# Altium schematic sheet 4_cyber60-mxhs_power.SchDoc: =ProjectTitle
size A4; Address1: github.com/4pplet/cyber60; Address2: Licence: CERN-OHL-S; SheetNumber: 4; SheetTotal: 5
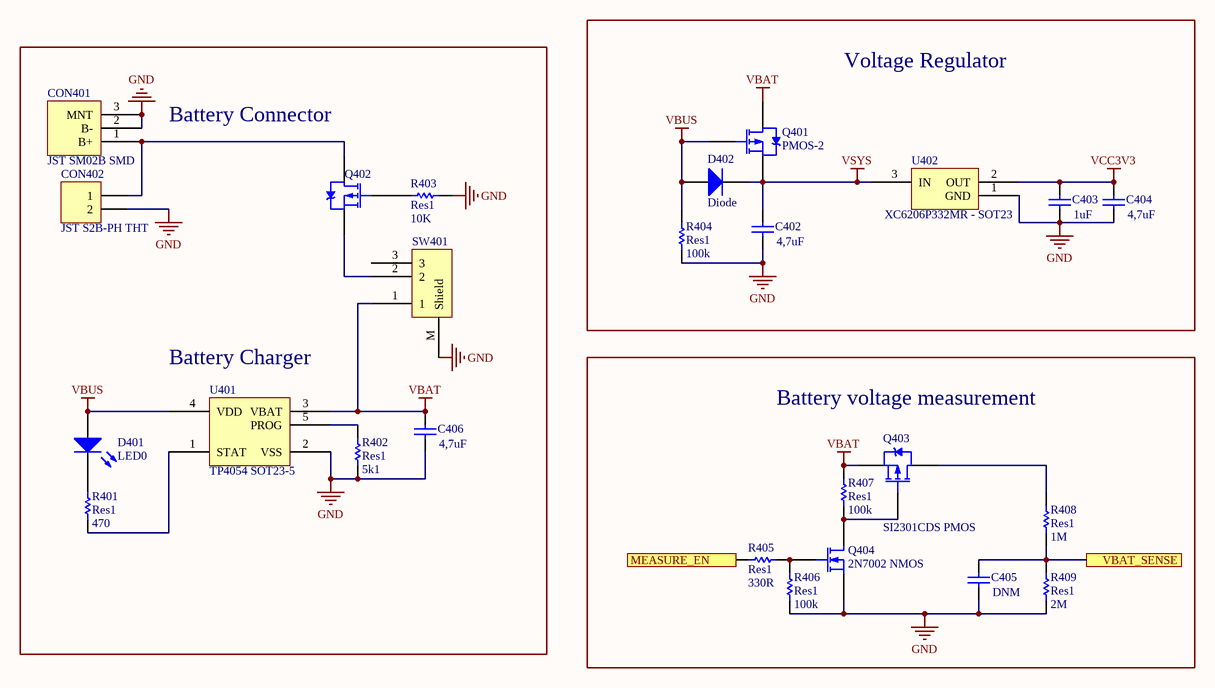
[diagram p0: 4_cyber60-mxhs_power.SchDoc]

## Parts
C402  value 4,7uF  [C0603[1608]]
C403  value 1uF  [C0603[1608]]
C404  value 4,7uF  [C0603[1608]]
C405  DNM  [C0603[1608]]  (no BOM)
C406  value 4,7uF  [C0603[1608]]
CON401  JST SM02B SMD  [JST SM02B-SRSS-TB]
CON402  JST S2B-PH THT  [JST S2B-PH-K(LF)(SN)]  (no BOM)
D401  LED0  [LED0603[1608]]
D402  Diode  [SOD-123]
Q401  PMOS-2  [SOT-23-3]
Q402  PMOS-2  [SOT-23-3]  (value not drawn)
Q403  SI2301CDS PMOS  [SOT-23-3]
Q404  2N7002 NMOS  [SOT-23-3]
R401  Res1  value 470  [R0603[1608]]
R402  Res1  value 5k1  [R0603[1608]]
R403  Res1  value 10K  [R0603[1608]]
R404  Res1  value 100k  [R0603[1608]]
R405  Res1  value 330R  [R0603[1608]]
R406  Res1  value 100k  [R0603[1608]]
R407  Res1  value 100k  [R0603[1608]]
R408  Res1  value 1M  [R0603[1608]]
R409  Res1  value 2M  [R0603[1608]]
SW401  Korean Hroparts Elec K3-1296S-E2  [Korean Hroparts Elec K3-1296S-E2]  (value not drawn)
U401  TP4054 SOT23-5  [SOT-23-5]
U402  XC6206P332MR - SOT23  [SOT-23-3]

## Blocks framed on the sheet
Voltage Regulator: C402-C404 D402 Q401 R404 U402
Battery voltage measurement: C405 Q403 Q404 R405-R409

## Ports
MEASURE_EN, VBAT_SENSE

## Nets
GND: C402.1 C403.1 C404.1 C405.1 C406.1 CON401.2(B-) CON401.3(MNT) CON402.2 Q404.2(S) R402.2 R403.2 R404.2 R406.2 R409.2 SW401.M(Shield) U401.2(VSS) U402.1(GND)
VBAT: C406.2 Q401.3(D) Q403.2(S) R407.1 SW401.1 U401.3(VBAT)
VBUS: D401.1(A) D402.1(A) Q401.1(G) R404.1 U401.4(VDD)
VCC3V3: C403.2 C404.2 U402.2(OUT)
VSYS: C402.2 D402.2(K) Q401.2(S) U402.3(IN)
MEASURE_EN: R405.1 ; port MEASURE_EN
VBAT_SENSE: C405.2 R408.2 R409.1 ; port VBAT_SENSE
NetCON401_1: CON401.1(B+) CON402.1 Q402.3(D)
NetD401_2: D401.2(K) R401.2
NetQ402_1: Q402.1(G) R403.1
NetQ402_2: Q402.2(S) SW401.2
NetQ403_1: Q403.1(G) Q404.3(D) R407.2
NetQ403_3: Q403.3(D) R408.1
NetQ404_1: Q404.1(G) R405.2 R406.1
NetR401_1: R401.1 U401.1(STAT)
NetR402_1: R402.1 U401.5(PROG)

Not connected (* = marked no-connect by the designer): SW401 3

## Notes on the sheet
- Battery Connector
- (near U401) Battery Charger
- Title
- Size:
- Date:
- A4
- Number:
- Time:
- Revision:
- Sheet
- of
- File:

## Library data of the parts
C402 C404 C406 = Cap: Capacitor; MRF.Part: CL10A475KO8NNNC; LCSC MFG: Samsung Electro-Mechanics; LCSC Part #: C19666
C403 = Cap: Capacitor; MRF.Part: CL10A105KB8NNNC; MFG: KEMET; MFGPN: C0603C104M5RACTU; LCSC MFG: Samsung Electro-Mechanics; Version: 0603 imperial; LCSC Part #: C15849
C405 = Cap: Capacitor; Value: DNM; Version: 0603 imperial
CON401 = JST S2B-PH-SM4-TB: MRF.Part: SM02B-SRSS-TB(LF)(SN); LCSC MFG: JST Sales America; LCSC Part #: C160402
CON402 = Header 2: Header, 2-Pin; MRF.Part: S2B-PH-K(LF)(SN); LCSC MFG: JST Sales America; LCSC Part #: C265016
D401 = LED0: Typical INFRARED GaAs LED; MRF.Part: 19-213/Y2C-CQ2R2L/3T(CY); LCSC MFG: Everlight Elec; LCSC Part #: C72038
D402 = Diode: Default Diode; MRF.Part: B5819W; LCSC MFG: Changjiang Electronics Tech (CJ); Version: SOD-123; LCSC Part #: C8598
Q401 Q403 = PMOS-2: P-Channel Power MOSFET; MRF.Part: SI2301CDS-T1-GE3; Note: Pin 4 not drawn and electrically connected to Pin 2.; LCSC MFG: Vishay Intertech; LCSC Part #: C10487
Q402 = PMOS-2: P-Channel Power MOSFET; MRF.Part: SI2301CDS-T1-GE3; LCSC MFG: Vishay Intertech; LCSC Part #: C10487; Version: SOT23-3
Q404 = MOSFET-N: N-Channel MOSFET; LCSC MFG: Changjiang Electronics Tech (CJ); LCSC Part #: C8545; MRF.Part: 2N7002
R401 = Res1: Resistor; MRF.Part: 0603WAF4700T5E; MFG: Panasonic Electronic Components; MFGPN: ERJ-3EKF5101V; LCSC MFG: UNI-ROYAL(Uniroyal Elec); Version: 0603 imperial; LCSC Part #: C23179
R402 = Res1: Resistor; MRF.Part: 0603WAF5101T5E; MFG: Panasonic Electronic Components; MFGPN: ERJ-3EKF5101V; LCSC MFG: Uniroyal Elec; Version: 0603 imperial; LCSC Part #: C23186
R403 = Res1: Resistor; MRF.Part: 0603WAF1002T5E; MFG: Panasonic Electronic Components; MFGPN: ERJ-3EKF5101V; LCSC MFG: Uniroyal Elec; Version: 0603 imperial; LCSC Part #: C25804
R404 R406 R407 = Res1: Resistor; MRF.Part: 0603WAF1003T5E; LCSC MFG: Uniroyal Elec; Version: 0603 imperial; LCSC Part #: C25803
R405 = Res1: Resistor; MRF.Part: 0603WAF3300T5E; LCSC MFG: Uniroyal Elec; Version: 0603 imperial; LCSC Part #: C23138
R408 = Res1: Resistor; MRF.Part: 0603WAF1004T5E; LCSC MFG: Uniroyal Elec; Version: 0603 imperial; LCSC Part #: C22935
R409 = Res1: Resistor; MRF.Part: 0603WAF2004T5E; LCSC MFG: Uniroyal Elec; Version: 0603 imperial; LCSC Part #: C22976
U401 = MCP73831: LCSC MFG: Nanjing Extension Microelectronics; LCSC Part #: C32574; MRF.Part: TP4054
U402 = SOT23 LDO: LCSC MFG: Torex Semicon; MFG: Texas Instruments; MFGPN: TPS7A0533PDBZ; LCSC Part #: C5446; MRF.Part: XC6206P332MR
SW401 = Korean Hroparts Elec K3-1296S-E2: LCSC MFG: Korean Hroparts Elec; LCSC Part #: C136659; MFGPN: K3-1296S-E2